# Altium schematic sheet D_OUTPUT.SchDoc
size A3; SheetNumber: 4; SheetTotal: 10
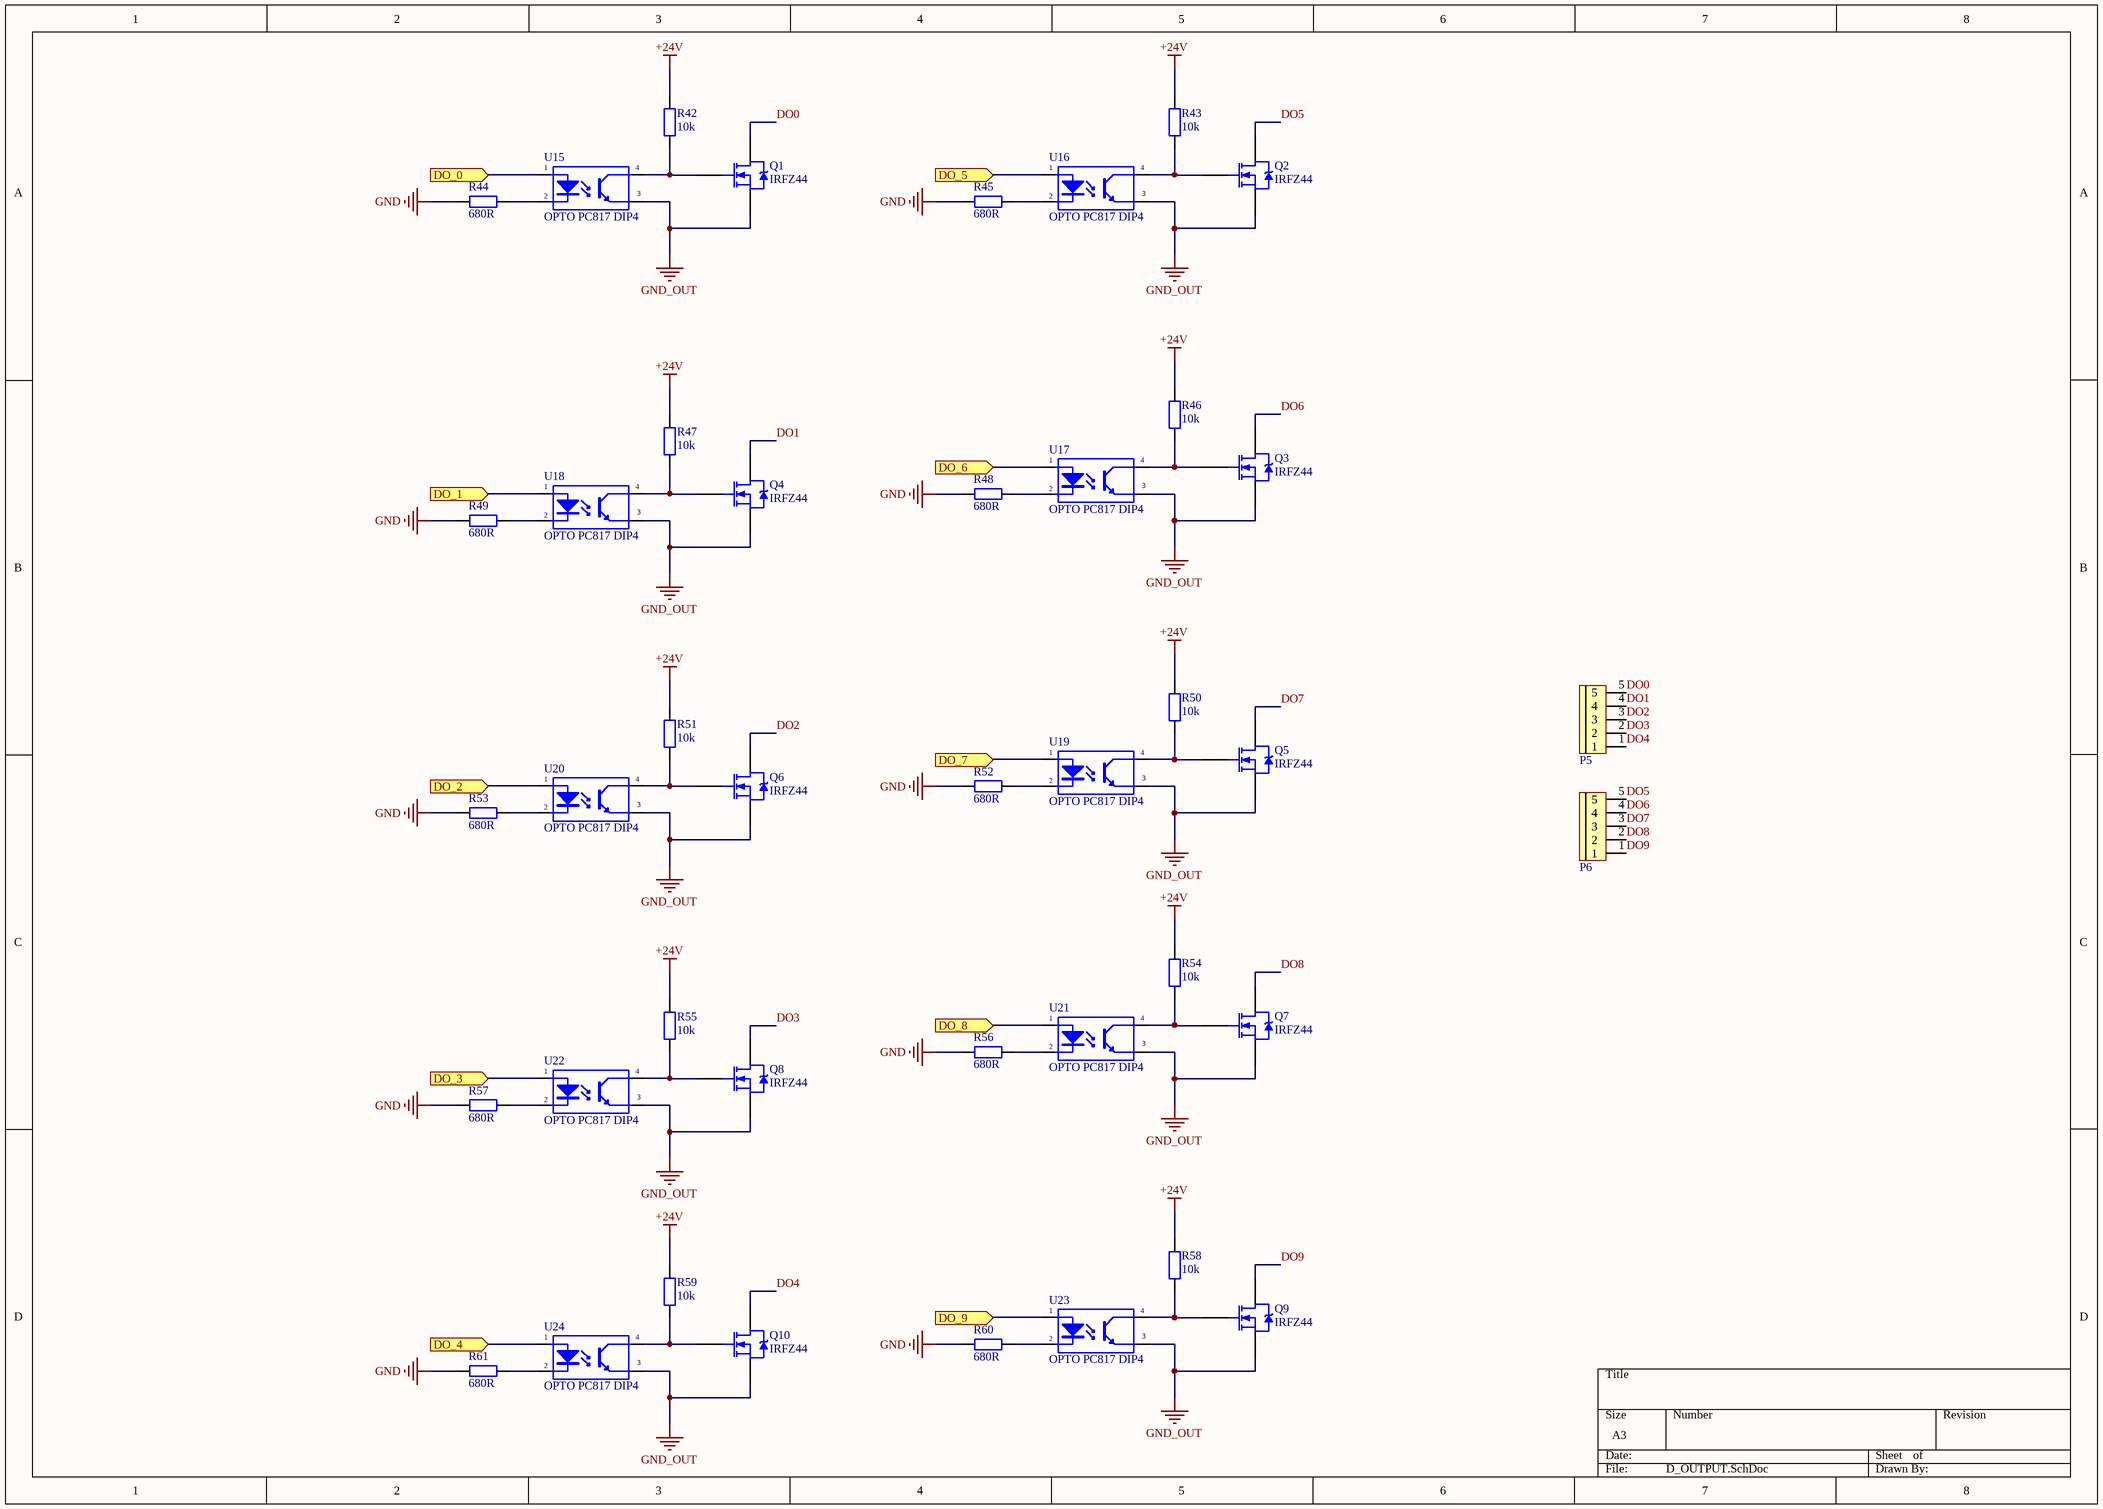
[diagram p0: D_OUTPUT.SchDoc]

## Parts
P5  CON 5 EDG5.08  [CON 5 5EDG5.08]  (value not drawn)
P6  CON 5 EDG5.08  [CON 5 5EDG5.08]  (value not drawn)
Q1  IRFZ44  [TO220]
Q2  IRFZ44  [TO220]
Q3  IRFZ44  [TO220]
Q4  IRFZ44  [TO220]
Q5  IRFZ44  [TO220]
Q6  IRFZ44  [TO220]
Q7  IRFZ44  [TO220]
Q8  IRFZ44  [TO220]
Q9  IRFZ44  [TO220]
Q10  IRFZ44  [TO220]
R42  10k  [tro smd 0805]
R43  10k  [tro smd 0805]
R44  680R  [tro smd 0805]
R45  680R  [tro smd 0805]
R46  10k  [tro smd 0805]
R47  10k  [tro smd 0805]
R48  680R  [tro smd 0805]
R49  680R  [tro smd 0805]
R50  10k  [tro smd 0805]
R51  10k  [tro smd 0805]
R52  680R  [tro smd 0805]
R53  680R  [tro smd 0805]
R54  10k  [tro smd 0805]
R55  10k  [tro smd 0805]
R56  680R  [tro smd 0805]
R57  680R  [tro smd 0805]
R58  10k  [tro smd 0805]
R59  10k  [tro smd 0805]
R60  680R  [tro smd 0805]
R61  680R  [tro smd 0805]
U15  OPTO PC817 DIP4  [DIP4]
U16  OPTO PC817 DIP4  [DIP4]
U17  OPTO PC817 DIP4  [DIP4]
U18  OPTO PC817 DIP4  [DIP4]
U19  OPTO PC817 DIP4  [DIP4]
U20  OPTO PC817 DIP4  [DIP4]
U21  OPTO PC817 DIP4  [DIP4]
U22  OPTO PC817 DIP4  [DIP4]
U23  OPTO PC817 DIP4  [DIP4]
U24  OPTO PC817 DIP4  [DIP4]

## Ports
DO_0 (in), DO_1 (in), DO_2 (in), DO_3 (in), DO_4 (in), DO_5 (in), DO_6 (in), DO_7 (in), DO_8 (in), DO_9 (in)

## Nets
+24V: R42.2 R43.2 R46.2 R47.2 R50.2 R51.2 R54.2 R55.2 R58.2 R59.2
GND: R44.1 R45.1 R48.1 R49.1 R52.1 R53.1 R56.1 R57.1 R60.1 R61.1
GND_OUT: Q1.3(S) Q2.3(S) Q3.3(S) Q4.3(S) Q5.3(S) Q6.3(S) Q7.3(S) Q8.3(S) Q9.3(S) Q10.3(S) U15.3(E) U16.3(E) U17.3(E) U18.3(E) U19.3(E) U20.3(E) U21.3(E) U22.3(E) U23.3(E) U24.3(E)
DO0: P5.5 Q1.2(D)
DO1: P5.4 Q4.2(D)
DO2: P5.3 Q6.2(D)
DO3: P5.2 Q8.2(D)
DO4: P5.1 Q10.2(D)
DO5: P6.5 Q2.2(D)
DO6: P6.4 Q3.2(D)
DO7: P6.3 Q5.2(D)
DO8: P6.2 Q7.2(D)
DO9: P6.1 Q9.2(D)
DO_0: U15.1(A) ; port DO_0
DO_1: U18.1(A) ; port DO_1
DO_2: U20.1(A) ; port DO_2
DO_3: U22.1(A) ; port DO_3
DO_4: U24.1(A) ; port DO_4
DO_5: U16.1(A) ; port DO_5
DO_6: U17.1(A) ; port DO_6
DO_7: U19.1(A) ; port DO_7
DO_8: U21.1(A) ; port DO_8
DO_9: U23.1(A) ; port DO_9
NetQ1_1: Q1.1(G) R42.1 U15.4(C)
NetQ2_1: Q2.1(G) R43.1 U16.4(C)
NetQ3_1: Q3.1(G) R46.1 U17.4(C)
NetQ4_1: Q4.1(G) R47.1 U18.4(C)
NetQ5_1: Q5.1(G) R50.1 U19.4(C)
NetQ6_1: Q6.1(G) R51.1 U20.4(C)
NetQ7_1: Q7.1(G) R54.1 U21.4(C)
NetQ8_1: Q8.1(G) R55.1 U22.4(C)
NetQ9_1: Q9.1(G) R58.1 U23.4(C)
NetQ10_1: Q10.1(G) R59.1 U24.4(C)
NetR44_2: R44.2 U15.2(K)
NetR45_2: R45.2 U16.2(K)
NetR48_2: R48.2 U17.2(K)
NetR49_2: R49.2 U18.2(K)
NetR52_2: R52.2 U19.2(K)
NetR53_2: R53.2 U20.2(K)
NetR56_2: R56.2 U21.2(K)
NetR57_2: R57.2 U22.2(K)
NetR60_2: R60.2 U23.2(K)
NetR61_2: R61.2 U24.2(K)

## Library data of the parts
P5 P6 = CON 5 EDG5.08: Cắm; Ten_Linh_Kien: CON 5 2EDG5.08-5P 5.08MM ( Xanh Cong); Ma_Hang: MH003589; Kieu_Chan: *; Don_Vi: Con; Ghi_Chu: *; Chung_Loai: Cắm
Q1-Q10 = FET IRFZ44 DIP: TO-220
R42 R43 R46 R47 R50 R51 R54 R55 R58 R59 = Tro 0805 1% 10k: Dán; Don_Vi: Con; So_Chan: 2; Ten_Linh_Kien: Trở 0805 1% 10k; Ma_Hang: MH005473; Chung_Loai: Dán; Kieu_Chan: *
R44 R45 R48 R49 R52 R53 R56 R57 R60 R61 = Tro 0805 1% 680R: Dán; Don_Vi: Con; So_Chan: 2; Ten_Linh_Kien: Trở 0805 1% 680R; Ma_Hang: MH005487; Chung_Loai: Dán; Kieu_Chan: *
U15-U24 = OPTO PC817 DIP4: Single Opto; Value: PC817